# Altium schematic sheet ServoPower.SchDoc
size A4
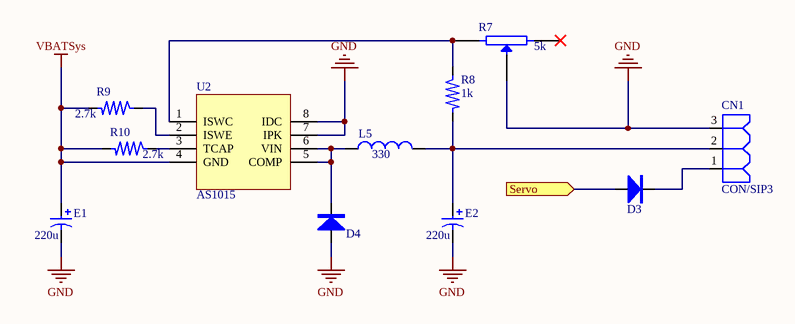
[diagram p0: ServoPower.SchDoc]

## Parts
CN1  CON/SIP3  [HDR1X3]
D3  DIODE  [DO-214]  (value not drawn)
D4  DIODE  [DO-214]  (value not drawn)
E1  220u  [CAP-E SMD-D]
E2  220u  [CAP-E SMD-D]
L5  330  [L7X7]
R7  5k  [RES ADJ-3296W]
R8  1k  [R0603]
R9  2.7k  [R0603]
R10  2.7k  [R0603]
U2  AS1015  [SOIC8]

## Ports
Servo (in)

## Nets
GND: CN1.3 D4.1(A) E1.2 E2.2 R7.3(W) U2.7(IPK) U2.8(IDC)
VBATSys: E1.1 R9.1 R10.1 U2.4(GND)
Servo: D3.1(A) ; port Servo
NetCN1_1: CN1.1 D3.2(K)
NetCN1_2: CN1.2 E2.1 L5.2 R8.1
NetD4_2: D4.2(K) L5.1 U2.5(COMP) U2.6(VIN)
NetR7_2: R7.2 R8.2 U2.1(ISWC)
NetR9_2: R9.2 U2.2(ISWE)
NetR10_2: R10.2 U2.3(TCAP)

Not connected (* = marked no-connect by the designer): R7 1*

## Library data of the parts
D3 D4 = DIODE: 二极管
E1 E2 = Capacitor-Polarity: 极性电容
L5 = INDUCTOR
R7 = Resistor-Potentiometer: 滑动变阻器
R8-R10 = Resistor: 电阻
U2 = MC34603: 充电电路芯片